# EAGLE schematic Controller-b (EAGLE 6.3)

## Sheet 1 of 2: controller
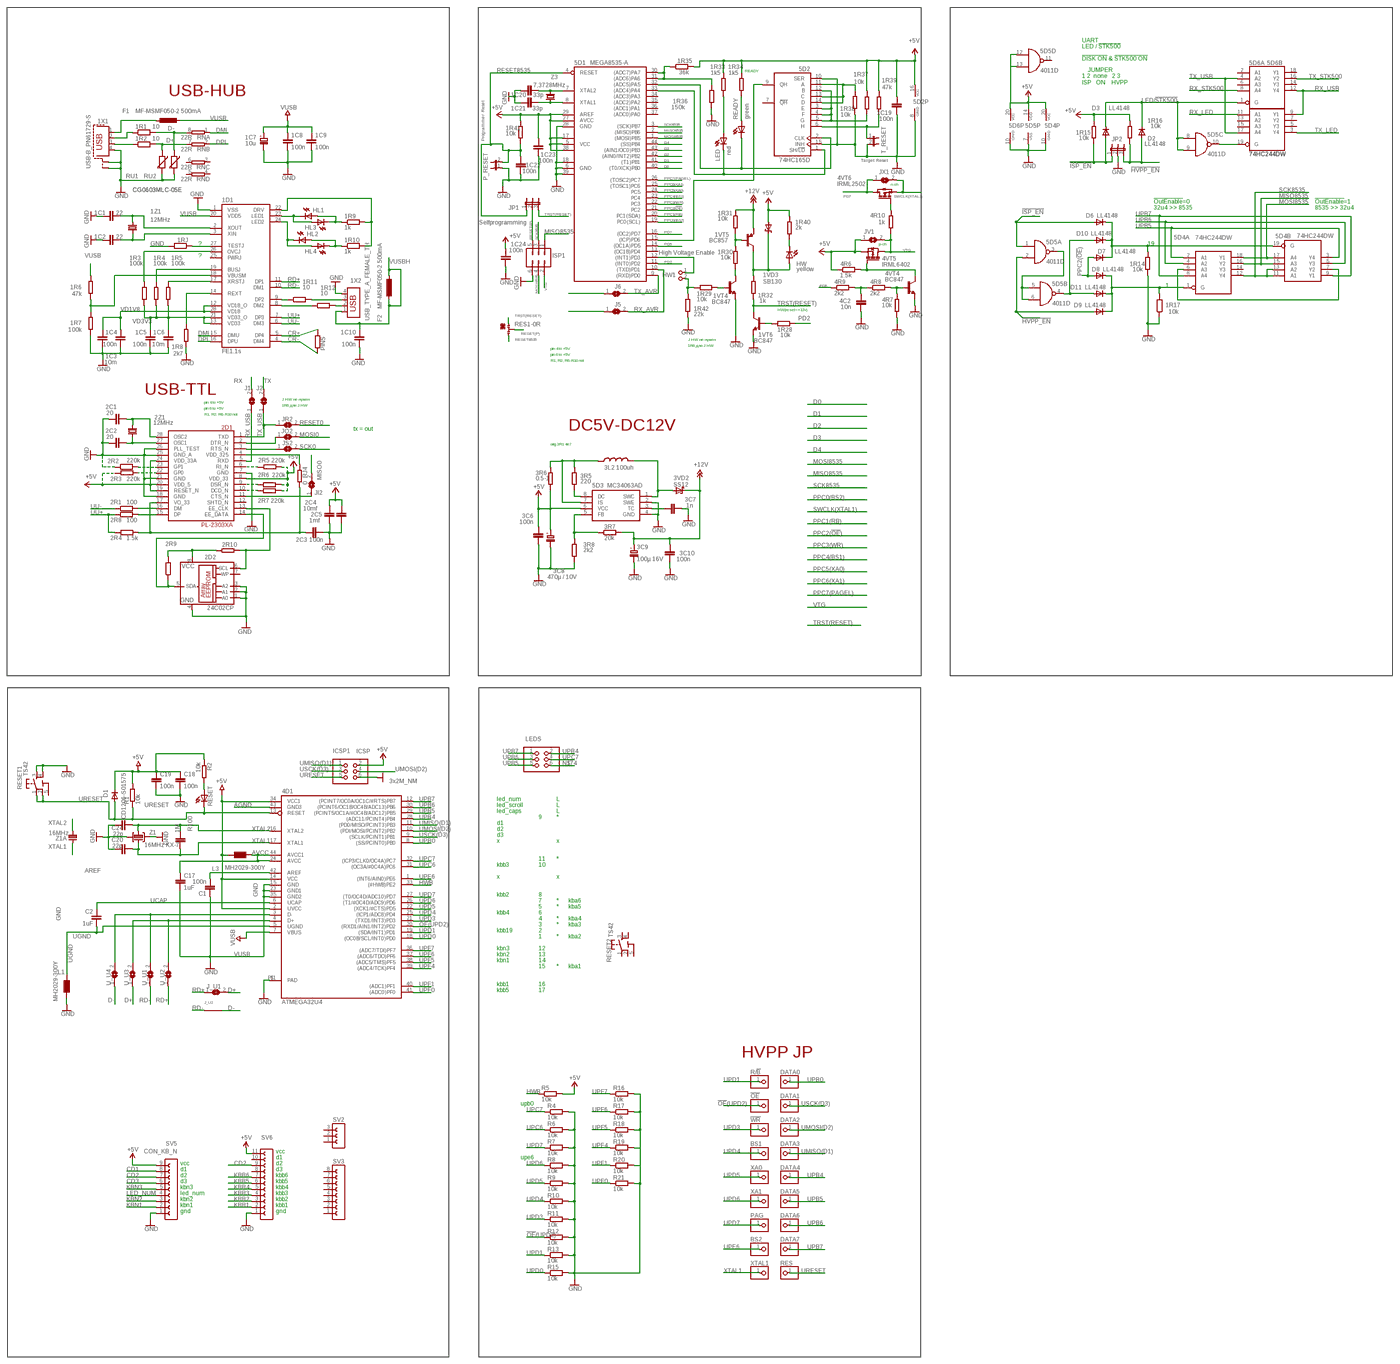
[diagram p0: schematic, sheet 1, overview]
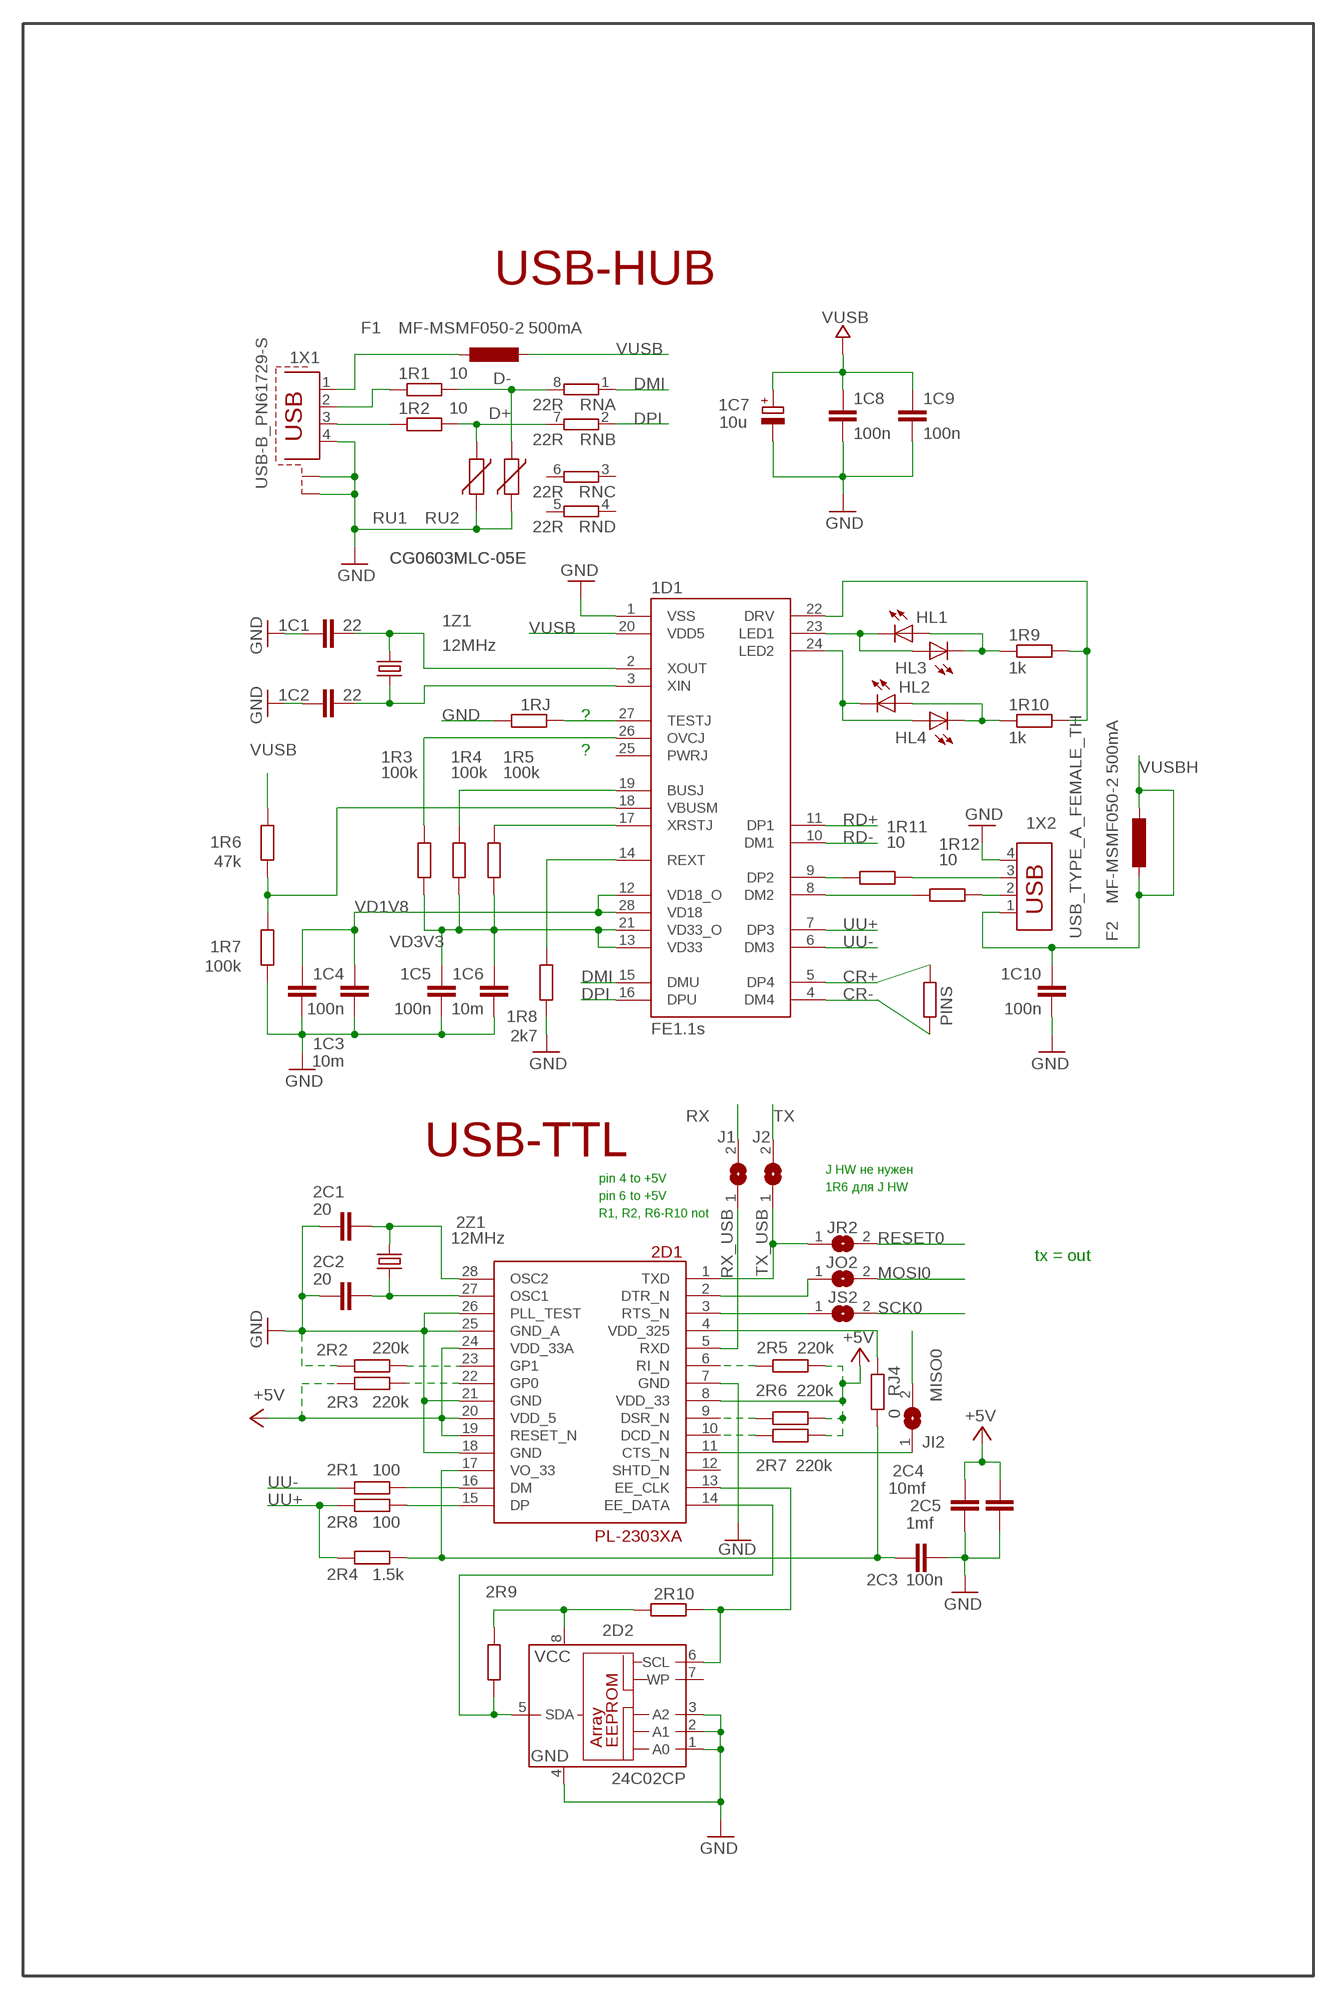
[diagram p1: schematic, sheet 1, part 1 of 4]
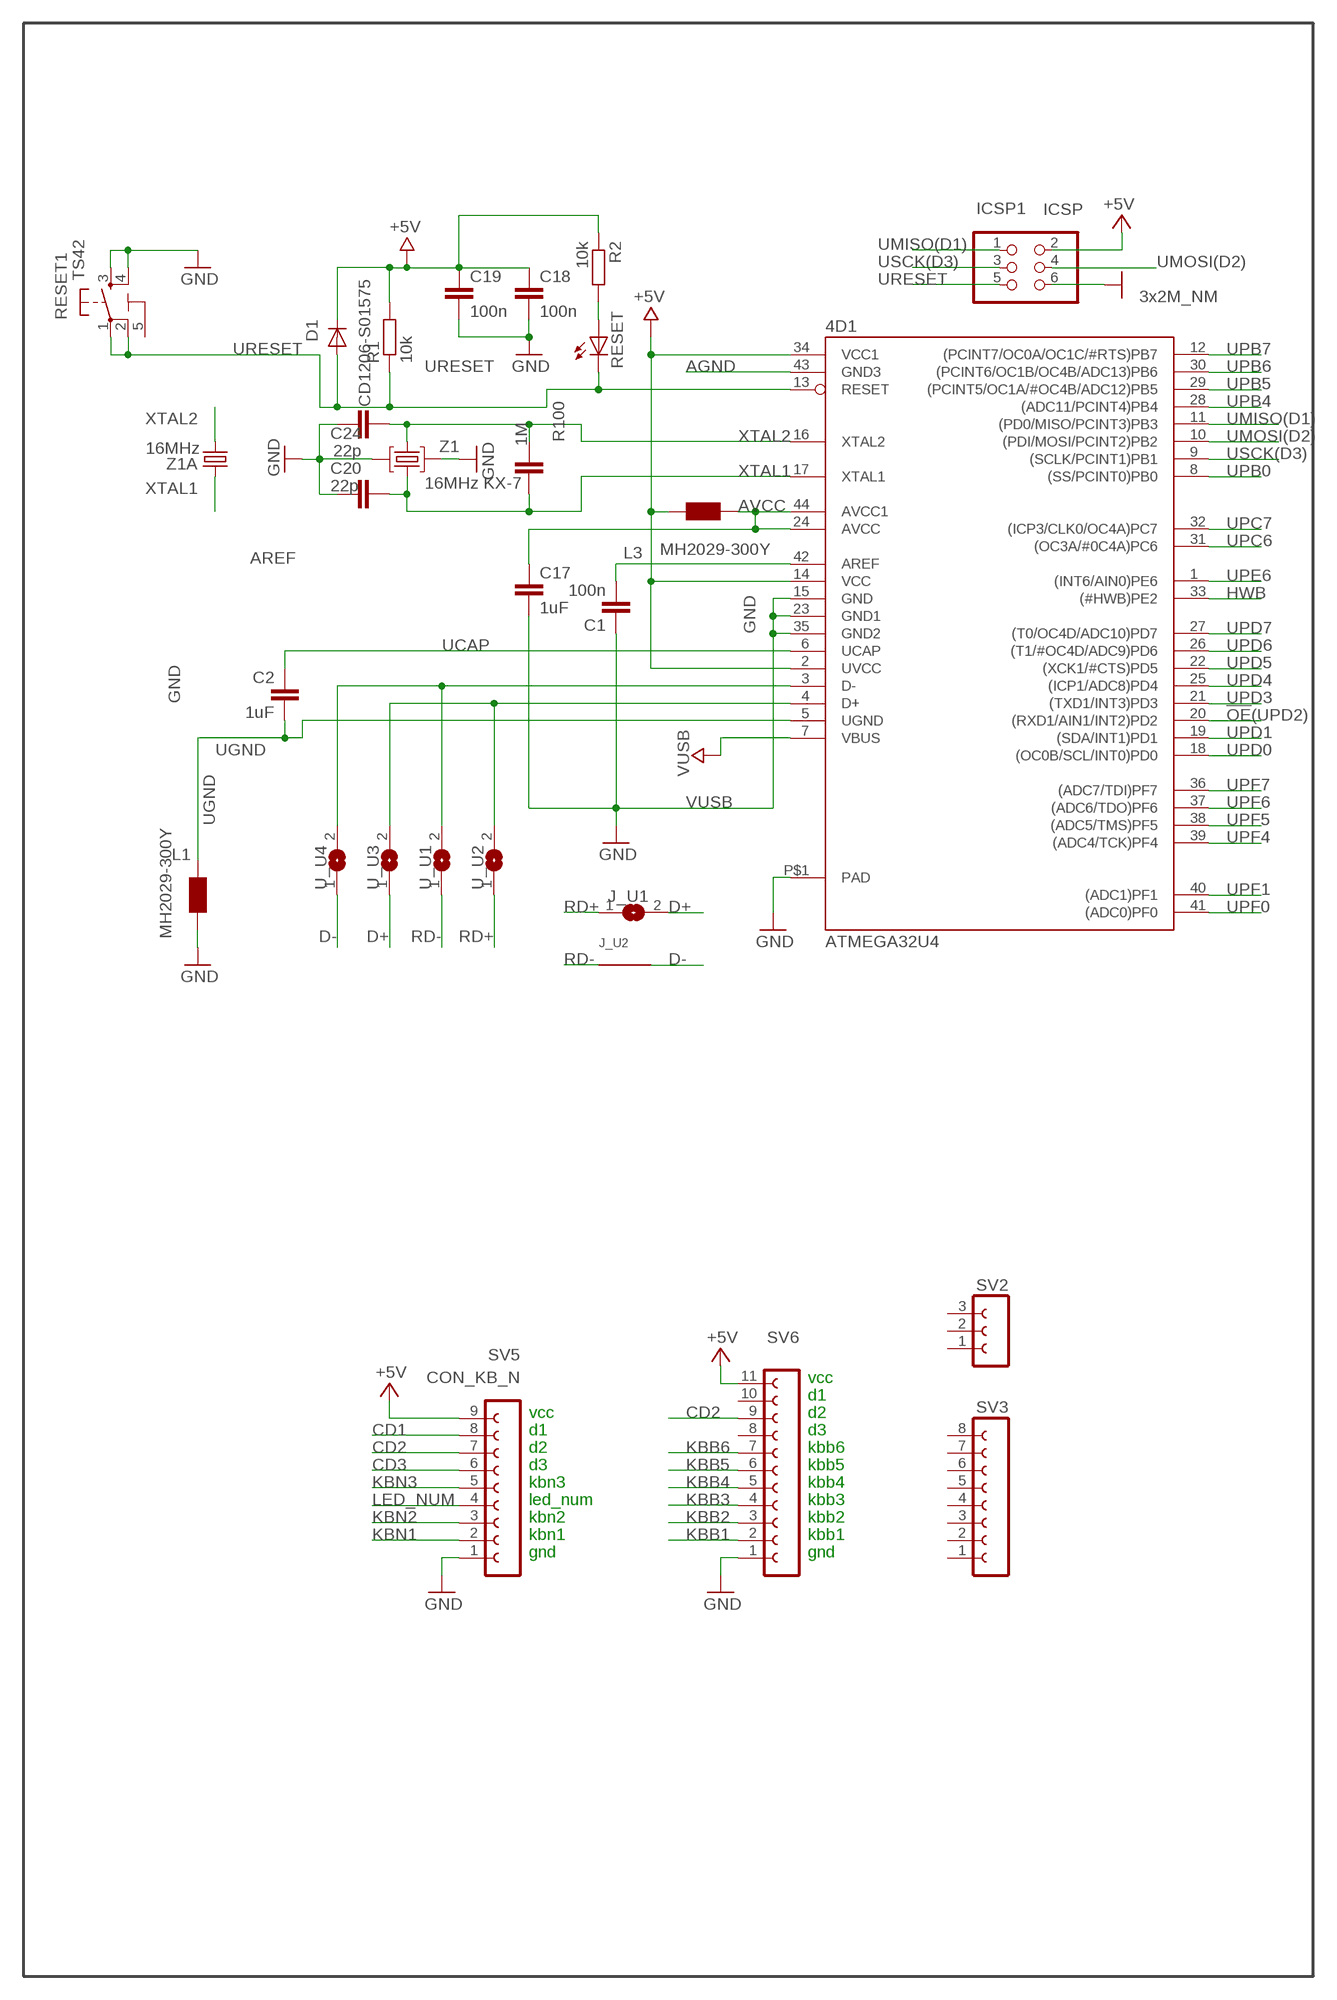
[diagram p2: schematic, sheet 1, part 2 of 4]
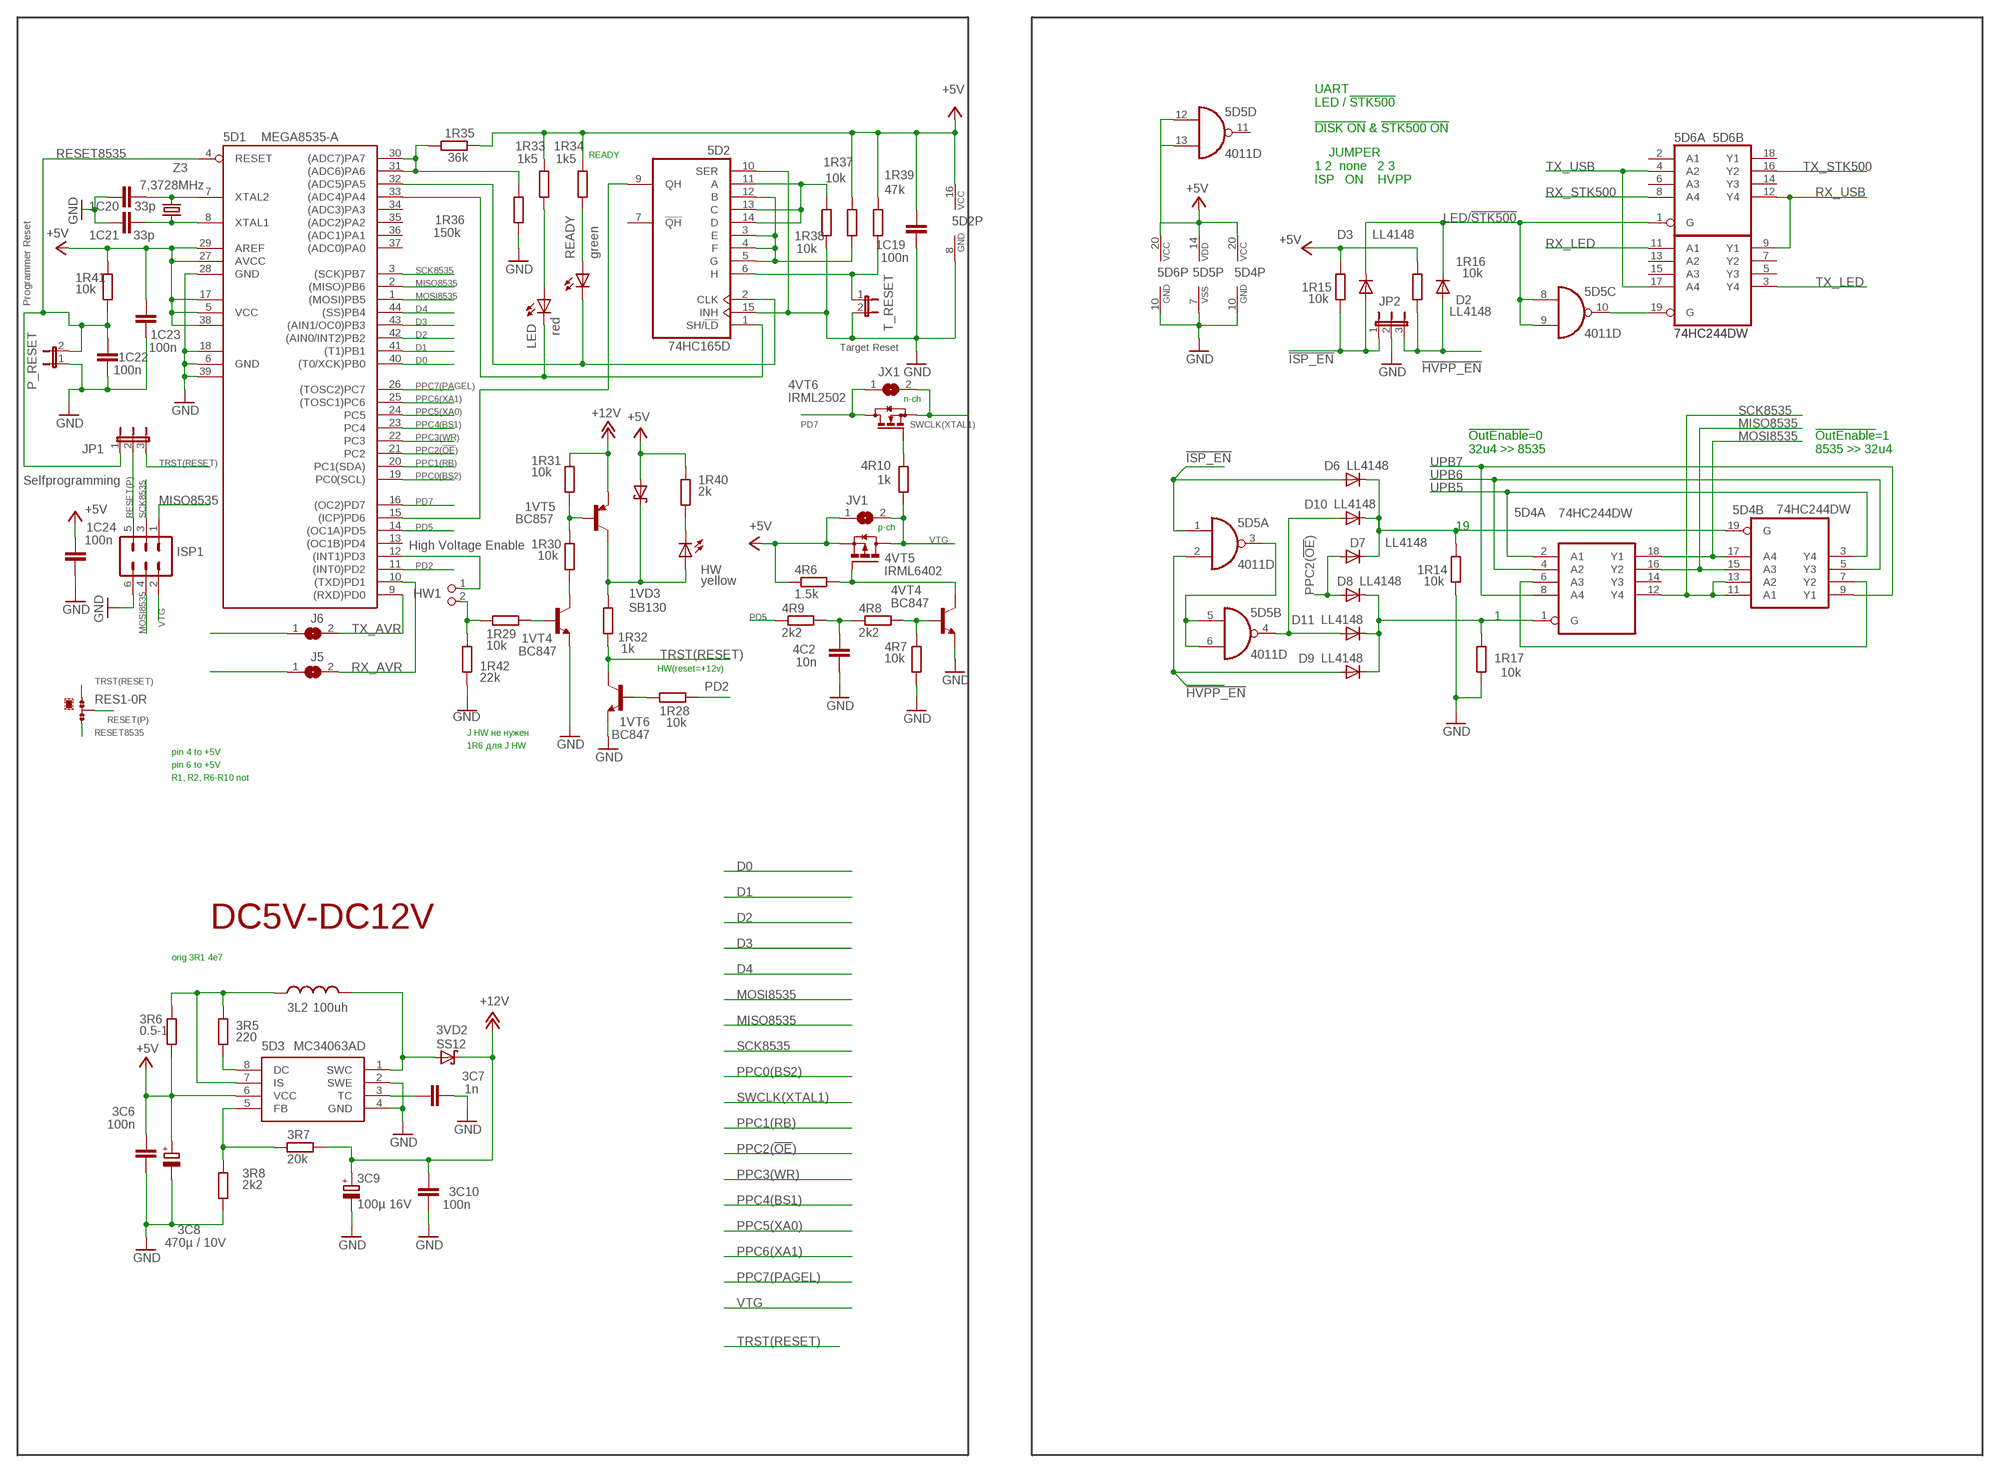
[diagram p3: schematic, sheet 1, part 3 of 4]
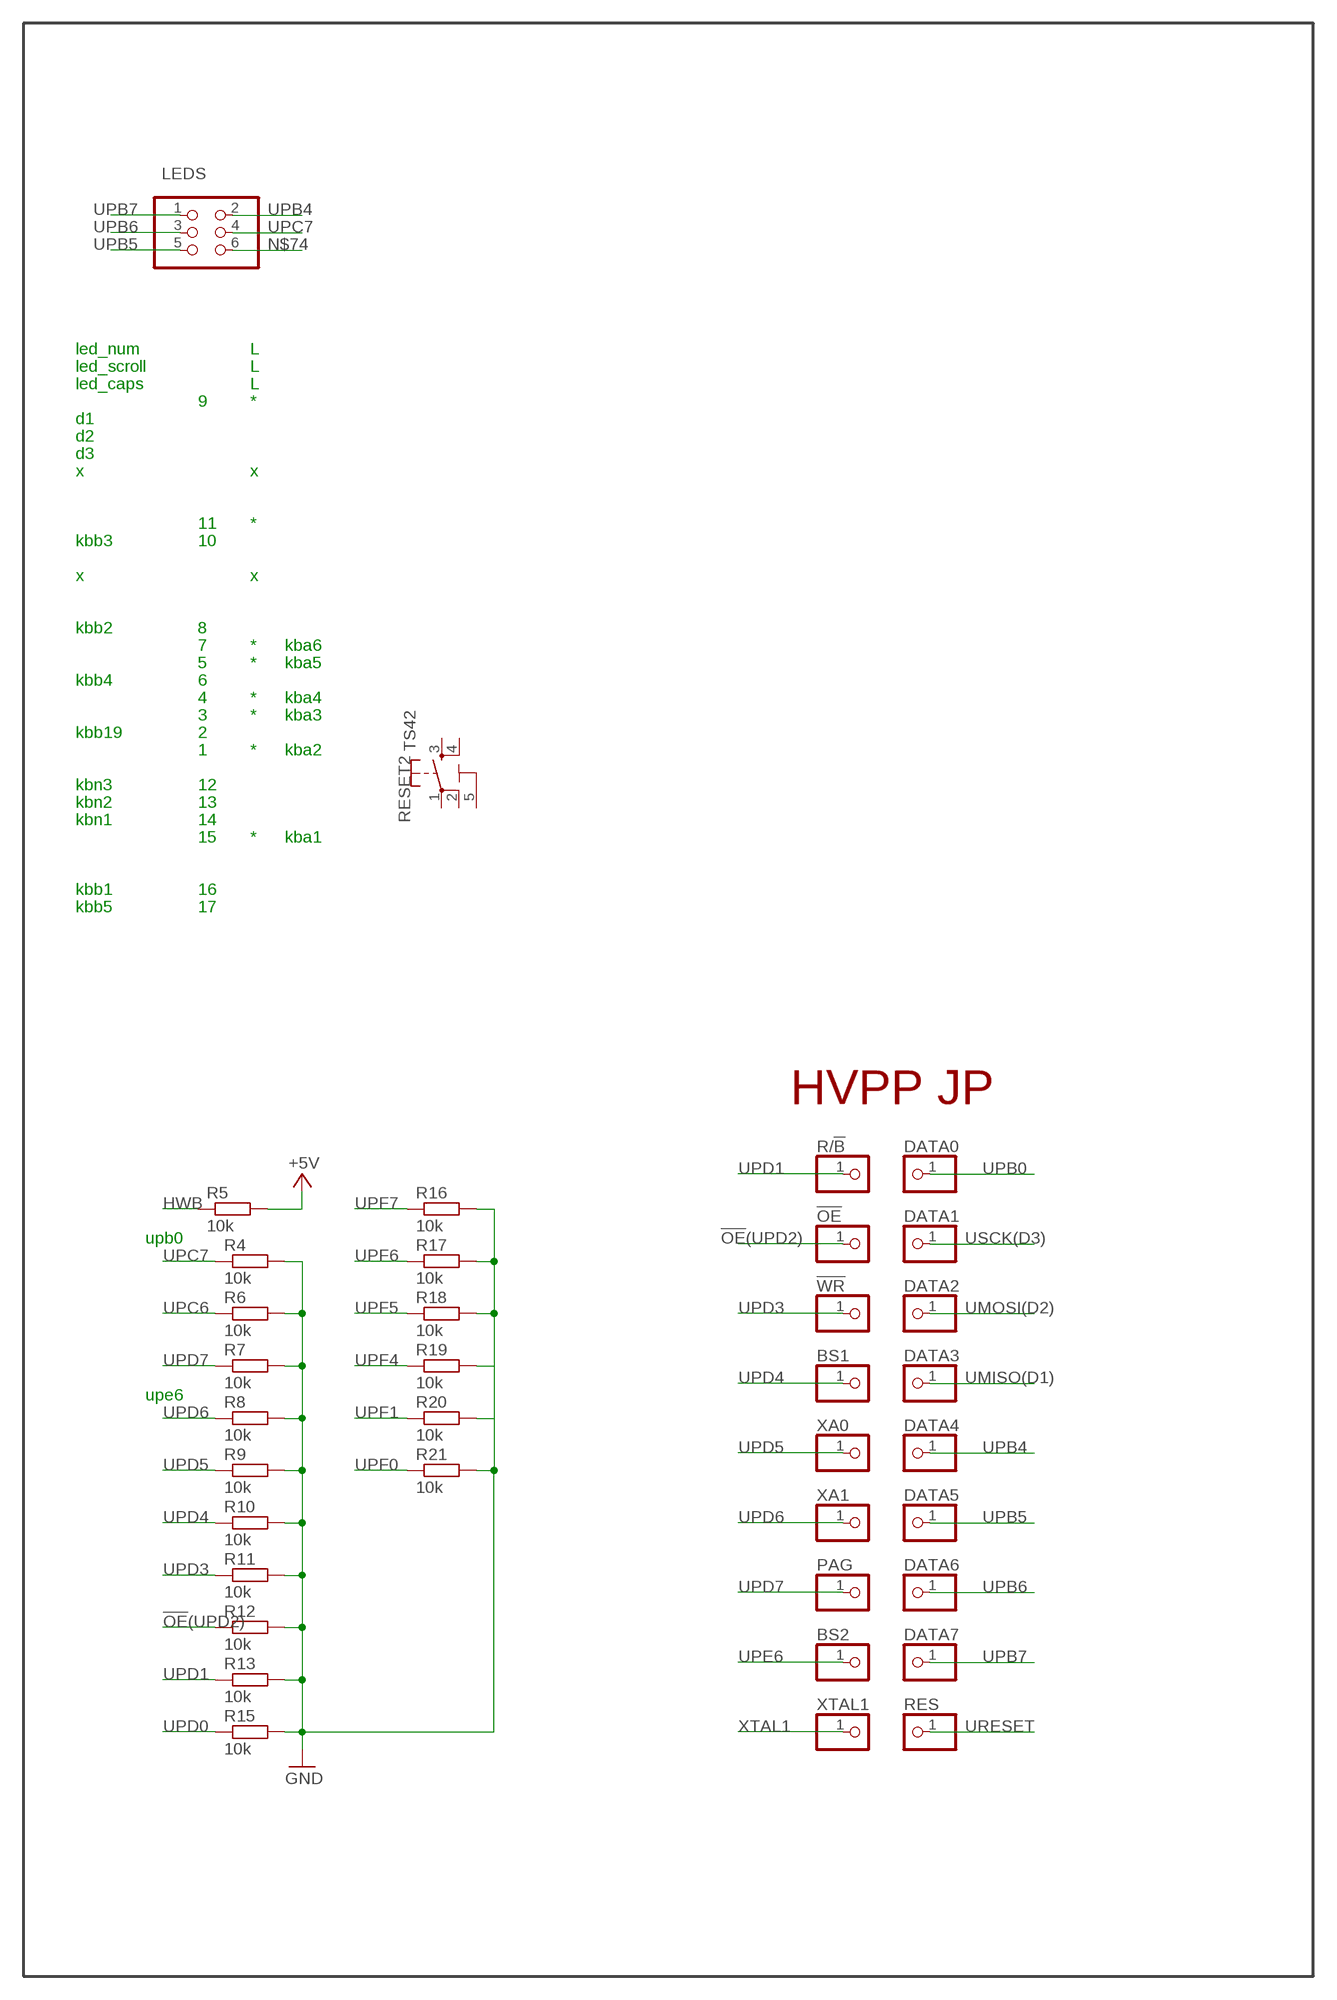
[diagram p4: schematic, sheet 1, part 4 of 4]

### Parts
1C1  22  C-EUC0603  [C0603]
1C2  22  C-EUC0603  [C0603]
1C3  10m  C-EUC1206  [C1206]
1C4  100n  C-EUC0805  [C0805]
1C5  100n  C-EUC0805  [C0805]
1C6  10m  C-EUC1206  [C1206]
1C7  10u  CPOL-EUSMCB  [SMC_B]
1C8  100n  C-EUC0805  [C0805]
1C9  100n  C-EUC0805  [C0805]
1C10  100n  C-EUC0805  [C0805]
1C19  100n  C-EUC0805  [C0805]
1C20  33p  C-EUC0805  [C0805]
1C21  33p  C-EUC0805  [C0805]
1C22  100n  C-EUC0805  [C0805]
1C23  100n  C-EUC0805  [C0805]
1C24  100n  C-EUC0805  [C0805]
1D1  FE1.1S  [FE1.1S_SSOP-28]
1R1  10  R-EU_R0603  [R0603]
1R2  10  R-EU_R0603  [R0603]
1R3  100k  R-EU_R0805  [R0805]
1R4  100k  R-EU_R0805  [R0805]
1R5  100k  R-EU_R1206W  [R1206W]
1R6  47k  R-EU_R1206W  [R1206W]
1R7  100k  R-EU_R0805  [R0805]
1R8  2k7  R-EU_R0805  [R0805]
1R9  1k  R-EU_R0805  [R0805]
1R10  1k  R-EU_R0805  [R0805]
1R11  10  R-EU_R0603  [R0603]
1R12  10  R-EU_R0603  [R0603]
1R14  10k  R-EU_M0805  [M0805]
1R15  10k  R-EU_M0805  [M0805]
1R16  10k  R-EU_M0805  [M0805]
1R17  10k  R-EU_M0805  [M0805]
1R28  10k  R-EU_R0805  [R0805]
1R29  10k  R-EU_M0805  [M0805]
1R30  10k  R-EU_M0805  [M0805]
1R31  10k  R-EU_M0805  [M0805]
1R32  1k  R-EU_M0805  [M0805]
1R33  1k5  R-EU_M0805  [M0805]
1R34  1k5  R-EU_M0805  [M0805]
1R35  36k  R-EU_M0805  [M0805]
1R36  150k  R-EU_R1206  [R1206]
1R37  10k  R-EU_M0805  [M0805]
1R38  10k  R-EU_M0805  [M0805]
1R39  47k  R-EU_M0805  [M0805]
1R40  2k  R-EU_R1206W  [R1206W]
1R41  10k  R-EU_M0805  [M0805]
1R42  22k  R-EU_M1206  [M1206]
1RJ  R-EU_R0805  [R0805]
1VD3  SB130  SCHOTTKY-DIODESMD  [SMB]
1VT4  BC847  [SOT23]
1VT5  BC857  BC857A-PNP-SOT23-BEC  [SOT23-BEC]
1VT6  BC847  [SOT23]
1X1  USB-B_PN61729-S  [USB-B_PN61729-S]
1X2  USB_TYPE_A_FEMALE_TH  [USB_TYPE_A_FEMALE_TH]
1Z1  12MHz  CRYSTALHC49S  [HC49/S]
2C1  20  C-EUC0805  [C0805]
2C2  20  C-EUC0805  [C0805]
2C3  100n  C-EUC0805  [C0805]
2C4  10mf  C-EUC1210  [C1210]
2C5  1mf  C-EUC0805  [C0805]
2D1  PL-2303XA  [SSOP28DB]
2D2  24C02CP  [DIL8]
2R1  100  R-EU_R0603  [R0603]
2R2  220k  R-EU_R0603  [R0603]
2R3  220k  R-EU_R1206W  [R1206W]
2R4  1.5k  R-EU_R0603  [R0603]
2R5  220k  R-EU_R1206W  [R1206W]
2R6  220k  R-EU_R0603  [R0603]
2R7  220k  R-EU_R0603  [R0603]
2R8  100  R-EU_R0603  [R0603]
2R9  R-EU_R0805  [R0805]
2R10  R-EU_R0805  [R0805]
2Z1  12MHz  CRYSTALHC49S  [HC49/S]
3C6  100n  C-EU025-024X044  [C025-024X044]
3C7  1n  C-EU025-025X050  [C025-025X050]
3C8  470µ / 10V  RCL_CPOL-EUE3.5-8  [RCL_E3,5-8]
3C9  100µ 16V  RCL_CPOL-EUE3.5-8  [RCL_E3,5-8]
3C10  100n  C-EU025-025X050  [C025-025X050]
3L2  100uh  L-US0207/10  [0207/10]
3R5  220  R-EU_R1206  [R1206]
3R6  0.5-1  R-EU_M1206  [M1206]
3R7  20k  R-EU_M0805  [M0805]
3R8  2k2  R-EU_M0805  [M0805]
3VD2  SS12  SCHOTTKY-DIODESMD  [SMB]
4C2  10n  C-EUC1206  [C1206]
4D1  ATMEGA32U4  SMARTPRJ_ATMEGA32U4-XUAU  [SMARTPRJ_TQFP44-PAD]
4R6  1.5k  R-EU_M0805  [M0805]
4R7  10k  R-EU_M0805  [M0805]
4R8  2k2  R-EU_M1206  [M1206]
4R9  2k2  R-EU_M0805  [M0805]
4R10  1k  R-EU_M0805  [M0805]
4VT4  BC847  [SOT23]
4VT5  IRML6402  FDN360P  [SUPER-SOT3]
4VT6  IRML2502  BSS123  [SOT23]
5D1  MEGA8535-A  [TQFP44]
5D2  74HC165D  [SO16]
5D3  MC34063AD  [SOIC8]
5D4  74HC244DW  [SO20W]
5D5  4011D  [SO14]
5D6  74HC244DW  [SO20W]
!OE  PINHD-1X1  [1X01]
!WR  PINHD-1X1  [1X01]
BS1  PINHD-1X1  [1X01]
BS2  PINHD-1X1  [1X01]
C1  100n  C-EUC0603  [C0603-ROUND]
C2  1uF  C-EUC0603  [C0603]
C17  1uF  C-EUC0603  [C0603-ROUND]
C18  100n  C-EUC0603  [C0603]
C19  100n  C-EUC0603  [C0603-ROUND]
C20  22p  C-EUC0603  [C0603]
C24  22p  C-EUC0603  [C0603]
D1  CD1206-S01575  DIODE-MINIMELF  [MINIMELF]
D2  LL4148  [SOD80C]
D3  LL4148  [SOD80C]
D6  LL4148  [SOD80C]
D7  LL4148  [SOD80C]
D8  LL4148  [SOD80C]
D9  LL4148  [SOD80C]
D10  LL4148  [SOD80C]
D11  LL4148  [SOD80C]
DATA0  PINHD-1X1  [1X01]
DATA1  PINHD-1X1  [1X01]
DATA2  PINHD-1X1  [1X01]
DATA3  PINHD-1X1  [1X01]
DATA4  PINHD-1X1  [1X01]
DATA5  PINHD-1X1  [1X01]
DATA6  PINHD-1X1  [1X01]
DATA7  PINHD-1X1  [1X01]
F1  MF-MSMF050-2 500mA  L-EUL1812  [L1812]
F2  MF-MSMF050-2 500mA  L-EUL1812  [L1812]
HL1  LEDSML0603  [SML0603]
HL2  LEDSML0603  [SML0603]
HL3  LEDSML0603  [SML0603]
HL4  LEDSML0603  [SML0603]
HW  yellow  LEDSML0603  [SML0603]
HW1  High Voltage Enable  PINHEAD_PINHD-1X2  [PINHEAD_1X02]
ICSP1  ICSP  PINHD-2X3  [2X03]
ISP1  MA03-2  [MA03-2]
J1  SJ  [SJ]
J2  SJ  [SJ]
J5  SJ  [SJ]
J6  SJ  [SJ]
J_U1  SJ  [SJ]
J_U2  J  [R1206W]
JI2  SJ  [SJ]
JO2  SJ  [SJ]
JP1  Selfprogramming  JUMPER_JP2E  [JUMPER_JP2]
JP2  JP2E  [JP2]
JR2  SJ  [SJ]
JS2  SJ  [SJ]
JV1  SJ  [SJ]
JX1  SJ  [SJ]
L1  MH2029-300Y  WE-CBF_0805  [0805]
L3  MH2029-300Y  WE-CBF_0805  [0805]
LED  red  LEDSML0603  [SML0603]
LEDS  PINHD-2X3  [2X03]
P_RESET  JP1E  [JP1]
PAG  PINHD-1X1  [1X01]
PINS  R-EU_R0805  [R0805]
R1  10k  R-EU_M0805  [M0805]
R2  10k  R-EU_M0805  [M0805]
R4  10k  R-EU_M0805  [M0805]
R5  10k  R-EU_M1206  [M1206]
R6  10k  R-EU_M0805  [M0805]
R7  10k  R-EU_M0805  [M0805]
R8  10k  R-EU_M0805  [M0805]
R9  10k  R-EU_M0805  [M0805]
R10  10k  R-EU_M0805  [M0805]
R11  10k  R-EU_M0805  [M0805]
R12  10k  R-EU_M0805  [M0805]
R13  10k  R-EU_M0805  [M0805]
R15  10k  R-EU_M0805  [M0805]
R16  10k  R-EU_M0805  [M0805]
R17  10k  R-EU_M0805  [M0805]
R18  10k  R-EU_M0805  [M0805]
R19  10k  R-EU_M0805  [M0805]
R20  10k  R-EU_M0805  [M0805]
R21  10k  R-EU_M0805  [M0805]
R100  1M  C-EUC0805  [C0805]
R/!B  PINHD-1X1  [1X01]
READY  green  LEDSML0603  [SML0603]
RES  PINHD-1X1  [1X01]
RES1  0R-JUMPA  [A0R-JMP]
RESET  LEDSML0805  [SML0805]
RESET1  TS42  [TS42]
RESET2  TS42  [TS42]
RJ4  0  R-EU_R1206  [R1206]
RN  22R  4R-NCAY16  [CAY16]
RU1  CG0603MLC-05E  VARISTORCN0603  [CT/CN0603]
RU2  CG0603MLC-05E  VARISTORCN0603  [CT/CN0603]
SV2  FE03-1  [FE03-1]
SV3  FE08-1  [FE08]
SV5  CON_KB_N  FE09-1  [FE09]
SV6  FE12-1  [FE12]
T_RESET  JP1E  [JP1]
U_U1  SJ  [SJ]
U_U2  SJ  [SJ]
U_U3  SJ  [SJ]
U_U4  SJ  [SJ]
XA0  PINHD-1X1  [1X01]
XA1  PINHD-1X1  [1X01]
XTAL1  PINHD-1X1  [1X01]
Z1  16MHz KX-7  CRYSTAL-3.2-2.5  [CRYSTAL-3.2-2.5]
Z1A  16MHz  CRYSTALHC49S  [HC49/S]
Z3  7,3728MHz  CRYTALHC49U-V  [HC49U-V]

### Nets
3VUSB2: 2C3.1 2D1.17(VO_33) 2R4.1 RJ4.2
!HVPP_EN: 1R16.1 5D5.2(A:I1) D2.A D9.A JP2.3
!ISP_EN: 1R15.1 5D5.1(A:I0) D3.A D6.A JP2.1
!OE741: 1R17.2 5D4.1(A:G) D8.C D9.C D11.C
!OE!(UPD2): 4D1.20((RXD1/AIN1/INT2)PD2) !OE.1 R12.1
+5V: 1C19.1 1C23.2 1C24.2 1R15.2 1R16.2 1R33.2 1R34.2 1R35.2 1R37.1 1R39.1 1R40.2 1R41.2 1VD3.A 2C4.2 2C5.2 2D1.8(VDD_33) 2D1.19(RESET_N) 2D1.20(VDD_5) 2D1.24(VDD_33A) 2R3.1 2R5.2 2R6.1 2R7.1 3C6.1 3C8.+ 3R6.1 4D1.2(UVCC) 4D1.14(VCC) 4D1.34(VCC1) 4R6.1 4VT5.2(S) 5D1.5(VCC) 5D1.17(VCC1) 5D1.27(AVCC) 5D1.29(AREF) 5D1.38(VCC2) 5D2.16(VCC) 5D3.6(VCC) 5D4.20(P:VCC) 5D5.12(D:I0) 5D5.13(D:I1) 5D5.14(P:VDD) 5D6.20(P:VCC) C18.1 C19.1 D1.C ICSP1.2 JV1.1 L3.1 R1.2 R2.1 R5.2 SV5.9 SV6.11 ; also sheet 2
+12V: 1R31.2 1VT5.E 3C9.+ 3C10.2 3R7.2 3VD2.C
AGND: 4D1.43(GND3)
AREF [aref]: 4D1.42(AREF) C1.2
AVCC: 4D1.24(AVCC) 4D1.44(AVCC1) C17.1 L3.2
CD1: SV5.8
CD2: SV5.7 SV6.9
CD3: SV5.6
CR+: 1D1.5(DP4) PINS.2
CR-: 1D1.4(DM4) PINS.1
D0: 5D1.40((T0/XCK)PB0)
D1: 5D1.41((T1)PB1)
D2: 5D1.42((AIN0/INT2)PB2)
D3: 5D1.43((AIN1/OC0)PB3)
D4: 5D1.44((SS)PB4) ; also sheet 2
D+: 1R2.2 J_U1.2 RN.7 RU1.1 U_U3.1
D-: 1R1.2 J_U2.1 RN.8 RU2.1 U_U4.1
DMI: 1D1.15(DMU) RN.1
DPI: 1D1.16(DPU) RN.2
GND: 1C1.1 1C2.1 1C3.2 1C4.2 1C5.2 1C6.2 1C7.- 1C8.1 1C9.1 1C10.2 1C19.2 1C20.1 1C21.1 1C22.1 1C23.1 1C24.1 1D1.1(VSS) 1R7.1 1R8.1 1R14.1 1R17.1 1R36.1 1R38.1 1R42.1 1RJ.2 1VT4.2(E) 1VT6.2(E) 1X1.4 1X1.S1 1X1.S2 1X2.4 2C1.1 2C2.1 2C3.2 2C4.1 2C5.1 2D1.7(GND) 2D1.18(GND) 2D1.21(GND) 2D1.25(GND_A) 2D1.26(PLL_TEST) 2D2.1(A0) 2D2.2(A1) 2D2.3(A2) 2D2.4(GND) 2R2.1 3C6.2 3C7.2 3C8.- 3C9.- 3C10.1 3R8.1 4C2.1 4D1.15(GND) 4D1.23(GND1) 4D1.35(GND2) 4D1.P$1(PAD) 4R7.1 4VT4.2(E) 5D1.6(GND) 5D1.18(GND1) 5D1.28(GND) 5D1.39(GND2) 5D2.8(GND) 5D2.10(SER) 5D2.15(INH) 5D3.2(SWE) 5D3.4(GND) 5D4.10(P:GND) 5D5.7(P:VSS) 5D6.10(P:GND) C1.1 C17.2 C18.2 C19.2 C20.1 C24.2 ICSP1.6 ISP1.6 JP2.2 L1.2 P_RESET.1 R4.2 R6.2 R7.2 R8.2 R9.2 R10.2 R11.2 R12.2 R13.2 R15.2 R16.2 R17.2 R18.2 R19.2 R20.2 R21.2 RESET1.3 RESET1.4 RU1.2 RU2.2 SV5.1 SV6.1 T_RESET.2 Z1.2(GND) Z1.4(GND) ; supply symbol labelled 3x2M_NM ; also sheet 2
HWB: 4D1.33((#HWB)PE2) R5.1 ; also sheet 2
ID+: 1R2.1 1X1.3
ID-: 1R1.1 1X1.2
KBB1: SV6.2
KBB2: SV6.3
KBB3: SV6.4
KBB4: SV6.5
KBB5: SV6.6
KBB6: SV6.7
KBN1: SV5.2
KBN2: SV5.3
KBN3: SV5.5
LED/!STK500: 5D5.8(C:I0) 5D5.9(C:I1) 5D6.1(A:G) D2.C D3.C
LED_NUM: SV5.4
MISO0: JI2.2 ; also sheet 2
MISO8535: 5D1.2((MISO)PB6) 5D4.15(B:A3) 5D4.16(A:Y2) ISP1.1
MOSI0: JO2.2 ; also sheet 2
MOSI8535: 5D1.1((MOSI)PB5) 5D4.17(B:A4) 5D4.18(A:Y1) ISP1.4
N1: 5D1.33((ADC4)PA4) 5D2.1(SH/!LD) LED.C
N$2: 5D5.10(C:O) 5D6.19(B:G)
N$3: R2.2 RESET.A
N$4: 5D4.6(A:A3) 5D4.7(B:Y2)
N$5: 1D1.9(DP2) 1R11.1
N$6: 1D1.8(DM2) 1R12.1
N$7: 1X1.1 F1.2
N$8: 1C1.2 1D1.2(XOUT) 1Z1.1
N$9: 1C2.2 1D1.3(XIN) 1Z1.2
N$10: 1D1.17(XRSTJ) 1R5.2
N$11: 1D1.22(DRV) 1R9.2 1R10.2
N$12: 1R11.2 1X2.3
N$13: 1R12.2 1X2.2
N$14: 1D1.23(LED1) HL1.C HL3.A
N$15: 1D1.19(BUSJ) 1R4.2
N$16: 1D1.18(VBUSM) 1R6.1 1R7.2
N$17: 1D1.24(LED2) HL2.C HL4.A
N$18: 1R10.1 HL2.A HL4.C
N$19: 1D1.26(OVCJ) 1R3.2
N$20: 4D1.4(D+) U_U2.2 U_U3.2
N$21: 1D1.14(REXT) 1R8.2
N$23: 1D1.27(TESTJ) 1RJ.1
N$25: 4D1.3(D-) U_U1.2 U_U4.2
N$28: 1R34.1 READY.A
N$29: 5D5.3(A:O) 5D5.5(B:I0) 5D5.6(B:I1)
N$31: 1R9.1 HL1.A HL3.C
N$32: 1R35.1 1R36.2 5D1.30((ADC7)PA7) 5D1.31((ADC6)PA6)
N$33: 5D1.32((ADC5)PA5) 5D2.2(CLK) READY.C
N$34: 1R39.2 5D2.6(H) T_RESET.1
N$35: 5D1.12((INT1)PD3) HW1.1
N$36: 1R29.2 1R42.2 HW1.2
N$37: J6.1
N$39: 1R32.2 1VD3.C 1VT5.C HW.A
N$40: 1R29.1 1VT4.1(B)
N$41: J5.1
N$43: 1R14.2 5D4.19(B:G) D6.C D7.C D10.C
N$45: 1R30.1 1VT4.3(C)
N$46: 1R30.2 1R31.1 1VT5.B
N$47: 5D1.15((ICP)PD6) 5D2.9(QH)
N$48: 1R33.1 LED.A
N$49: 1R38.2 5D2.11(A) 5D2.13(C) 5D2.14(D)
N$52: 2D1.15(DP) 2R8.2
N$53: 2D1.16(DM) 2R1.2
N$54: 2D1.23(GP1) 2R2.2
N$55: 2D1.22(GP0) 2R3.2
N$56: 2C1.2 2D1.28(OSC2) 2Z1.2
N$57: 2C2.2 2D1.27(OSC1) 2Z1.1
N$58: 2D1.6(RI_N) 2R5.1
N$59: 2D1.9(DSR_N) 2R6.2
N$60: 2D1.10(DCD_N) 2R7.2
N$61: 2D1.11(CTS_N) JI2.1
N$62: 2D1.3(RTS_N) JS2.1
N$63: 2D1.2(DTR_N) JO2.1
N$64: 2D1.4(VDD_325) RJ4.1
N$65: 1R37.2 5D2.3(E) 5D2.4(F) 5D2.5(G) 5D2.12(B)
N$66: 2D1.14(EE_DATA) 2D2.5(SDA) 2R9.1
N$67: 2D2.8(VCC) 2R9.2 2R10.2
N$68: 2D1.13(EE_CLK) 2D2.6(SCL) 2R10.1
N$69: 1R28.2 1VT6.1(B)
N$70: 3R5.1 5D3.8(DC)
N$74: LEDS.6
N$75: 3L2.1 3R5.2 3R6.2 5D3.7(IS)
N$76: 5D5.4(B:O) D10.A D11.A
N$79: 3R7.1 3R8.2 5D3.5(FB)
N$80: 3L2.2 3VD2.A 5D3.1(SWC)
N$81: 3C7.1 5D3.3(TC)
N$82: 1C20.2 5D1.7(XTAL2) Z3.2
N$83: 1C21.2 5D1.8(XTAL1) Z3.1
N$84: 4R6.2 4VT4.3(C) 4VT5.1(G)
N$85: 4R7.2 4R8.2 4VT4.1(B)
N$86: 4C2.2 4R8.1 4R9.2
N$95: 1R40.1 HW.C
N$96: 4R10.2 4VT6.1(G)
PD2: 1R28.1 5D1.11((INT0)PD2)
PD5: 4R9.1 5D1.14((OC1A)PD5)
PD7: 4VT6.3(D) 5D1.16((OC2)PD7) JX1.1
PPC0(BS2): 5D1.19(PC0(SCL))
PPC1(RB): 5D1.20(PC1(SDA))
PPC2(!OE!): 5D1.21(PC2) D7.A D8.A
PPC3(WR): 5D1.22(PC3)
PPC4(BS1): 5D1.23(PC4)
PPC5(XA0): 5D1.24(PC5)
PPC6(XA1): 5D1.25((TOSC1)PC6)
PPC7(PAGEL): 5D1.26((TOSC2)PC7)
RD+: 1D1.11(DP1) J_U1.1 U_U2.1
RD-: 1D1.10(DM1) J_U2.2 U_U1.1
RESET0: JR2.2 ; also sheet 2
RESET8535: 1C22.2 1R41.1 5D1.4(RESET) JP1.1 P_RESET.2 RES1.3
RESET(P): ISP1.5 JP1.2 RES1.2
RX: J1.2
RX_AVR: 5D1.10((TXD)PD1) J5.2
RX_LED: 5D6.11(B:A1)
RX_STK500: 5D6.8(A:A4)
RX_USB: 2D1.5(RXD) 5D6.9(B:Y1) 5D6.12(A:Y4) J1.1
SCK0: JS2.2 ; also sheet 2
SCK8535: 5D1.3((SCK)PB7) 5D4.11(B:A1) 5D4.12(A:Y4) 5D4.13(B:A2) ISP1.3
SWCLK(XTAL1): 4VT6.2(S) JX1.2
TRST(RESET): 1R32.1 1VT6.3(C) JP1.3 RES1.1
TX: J2.2
TX_AVR: 5D1.9((RXD)PD0) J6.2
TX_LED: 5D6.3(B:Y4)
TX_STK500: 5D6.16(A:Y2)
TX_USB: 2D1.1(TXD) 5D6.4(A:A2) 5D6.17(B:A4) J2.1 JR2.1
UCAP: 4D1.6(UCAP) C2.1
UGND [gnd]: 4D1.5(UGND) C2.2 L1.1
UMISO(D1): 4D1.11((PD0/MISO/PCINT3)PB3) DATA3.1 ICSP1.1
UMOSI(D2): 4D1.10((PDI/MOSI/PCINT2)PB2) DATA2.1 ICSP1.4
UPB0: 4D1.8((SS/PCINT0)PB0) DATA0.1
UPB4: 4D1.28((ADC11/PCINT4)PB4) DATA4.1 LEDS.2
UPB5: 4D1.29((PCINT5/OC1A/#OC4B/ADC12)PB5) 5D4.2(A:A1) 5D4.3(B:Y4) DATA5.1 LEDS.5
UPB6: 4D1.30((PCINT6/OC1B/OC4B/ADC13)PB6) 5D4.4(A:A2) 5D4.5(B:Y3) DATA6.1 LEDS.3
UPB7: 4D1.12((PCINT7/OC0A/OC1C/#RTS)PB7) 5D4.8(A:A4) 5D4.9(B:Y1) DATA7.1 LEDS.1
UPC6: 4D1.31((OC3A/#0C4A)PC6) R6.1
UPC7: 4D1.32((ICP3/CLK0/OC4A)PC7) LEDS.4 R4.1
UPD0: 4D1.18((OC0B/SCL/INT0)PD0) R15.1
UPD1: 4D1.19((SDA/INT1)PD1) R13.1 R/!B.1
UPD3: 4D1.21((TXD1/INT3)PD3) !WR.1 R11.1
UPD4: 4D1.25((ICP1/ADC8)PD4) BS1.1 R10.1
UPD5: 4D1.22((XCK1/#CTS)PD5) R9.1 XA0.1
UPD6: 4D1.26((T1/#OC4D/ADC9)PD6) R8.1 XA1.1
UPD7: 4D1.27((T0/OC4D/ADC10)PD7) PAG.1 R7.1
UPE6: 4D1.1((INT6/AIN0)PE6) BS2.1
UPF0: 4D1.41((ADC0)PF0) R21.1
UPF1: 4D1.40((ADC1)PF1) R20.1
UPF4: 4D1.39((ADC4/TCK)PF4) R19.1
UPF5: 4D1.38((ADC5/TMS)PF5) R18.1
UPF6: 4D1.37((ADC6/TDO)PF6) R17.1
UPF7: 4D1.36((ADC7/TDI)PF7) R16.1
URESET: 4D1.13(RESET) D1.A ICSP1.5 R1.1 RES.1 RESET1.1 RESET1.2 RESET.C
USCK(D3): 4D1.9((SCLK/PCINT1)PB1) DATA1.1 ICSP1.3
UU+: 1D1.7(DP3) 2R4.2 2R8.1
UU-: 1D1.6(DM3) 2R1.1
VD1V8: 1C3.1 1C4.1 1D1.12(VD18_O) 1D1.28(VD18)
VD3V3: 1C5.1 1C6.1 1D1.13(VD33) 1D1.21(VD33_O) 1R3.1 1R4.1 1R5.1
VTG: 4R10.1 4VT5.3(D) ISP1.2 JV1.2
VUSB: 1C7.+ 1C8.2 1C9.2 1D1.20(VDD5) 1R6.2 4D1.7(VBUS) F1.1
VUSBH: 1C10.1 1X2.1 F2.1 F2.2
XTAL1: 4D1.17(XTAL1) C20.2 R100.2 XTAL1.1 Z1.3(C2) Z1A.2
XTAL2: 4D1.16(XTAL2) C24.1 R100.1 Z1.1(C1) Z1A.1
Unconnected: 1D1.25(PWRJ) 2D1.12(SHTD_N) 2D2.7(WP) 5D1.13((OC1B)PD4) 5D1.34((ADC3)PA3) 5D1.35((ADC2)PA2) 5D1.36((ADC1)PA1) 5D1.37((ADC0)PA0) 5D2.7(!QH) 5D4.14(A:Y3) 5D5.11(D:O) 5D6.2(A:A1) 5D6.5(B:Y3) 5D6.6(A:A3) 5D6.7(B:Y2) 5D6.13(B:A2) 5D6.14(A:Y3) 5D6.15(B:A3) 5D6.18(A:Y1) RESET2.1 RESET2.2 RESET2.3 RESET2.4 RN.3 RN.4 RN.5 RN.6 SV2.1 SV2.2 SV2.3 SV3.1 SV3.2 SV3.3 SV3.4 SV3.5 SV3.6 SV3.7 SV3.8 SV6.8 SV6.10

### Notes on the sheet
- UART
  LED / !STK500
- !DISK ON! & !STK500 ON
- READY
- JUMPER
  1 2  none   2 3
  ISP   ON    HVPP
- USB-HUB
- Programmer Reset
- Target Reset
- n-ch
- !OutEnable!=0
  32u4 >> 8535
- !OutEnable!=1
  8535 >> 32u4
- ? | p-ch | 19
- ?
- 1
- HW(reset=+12v)
- J HW не нужен
- 1R6 для J HW
- pin 4 to +5V
- pin 6 to +5V
- R1, R2, R6-R10 not
- USB-TTL
- J HW не нужен
- pin 4 to +5V
- 1R6 для J HW
- pin 6 to +5V
- R1, R2, R6-R10 not
- tx = out | DC5V-DC12V
- orig 3R1 4e7
- led_num | L
- led_scroll | L
- led_caps | L
- 9 | *
- d1
- d2
- d3
- x | x
- 11 | *
- kbb3 | 10
- x | x
- kbb2 | 8
- 7 | * | kba6
- 5 | * | kba5
- kbb4 | 6
- 4 | * | kba4
- 3 | * | kba3
- kbb19 | 2
- 1 | * | kba2
- kbn3 | 12
- kbn2 | 13
- kbn1 | 14
- 15 | * | kba1
- kbb1 | 16
- kbb5 | 17
- HVPP JP
- upb0
- vcc
- d1 | upe6
- vcc | d2
- d1 | d3
- d2 | kbb6
- d3 | kbb5
- kbn3 | kbb4
- led_num | kbb3
- kbn2 | kbb2
- kbn1 | kbb1
- gnd | gnd

## Sheet 2 of 2: куски
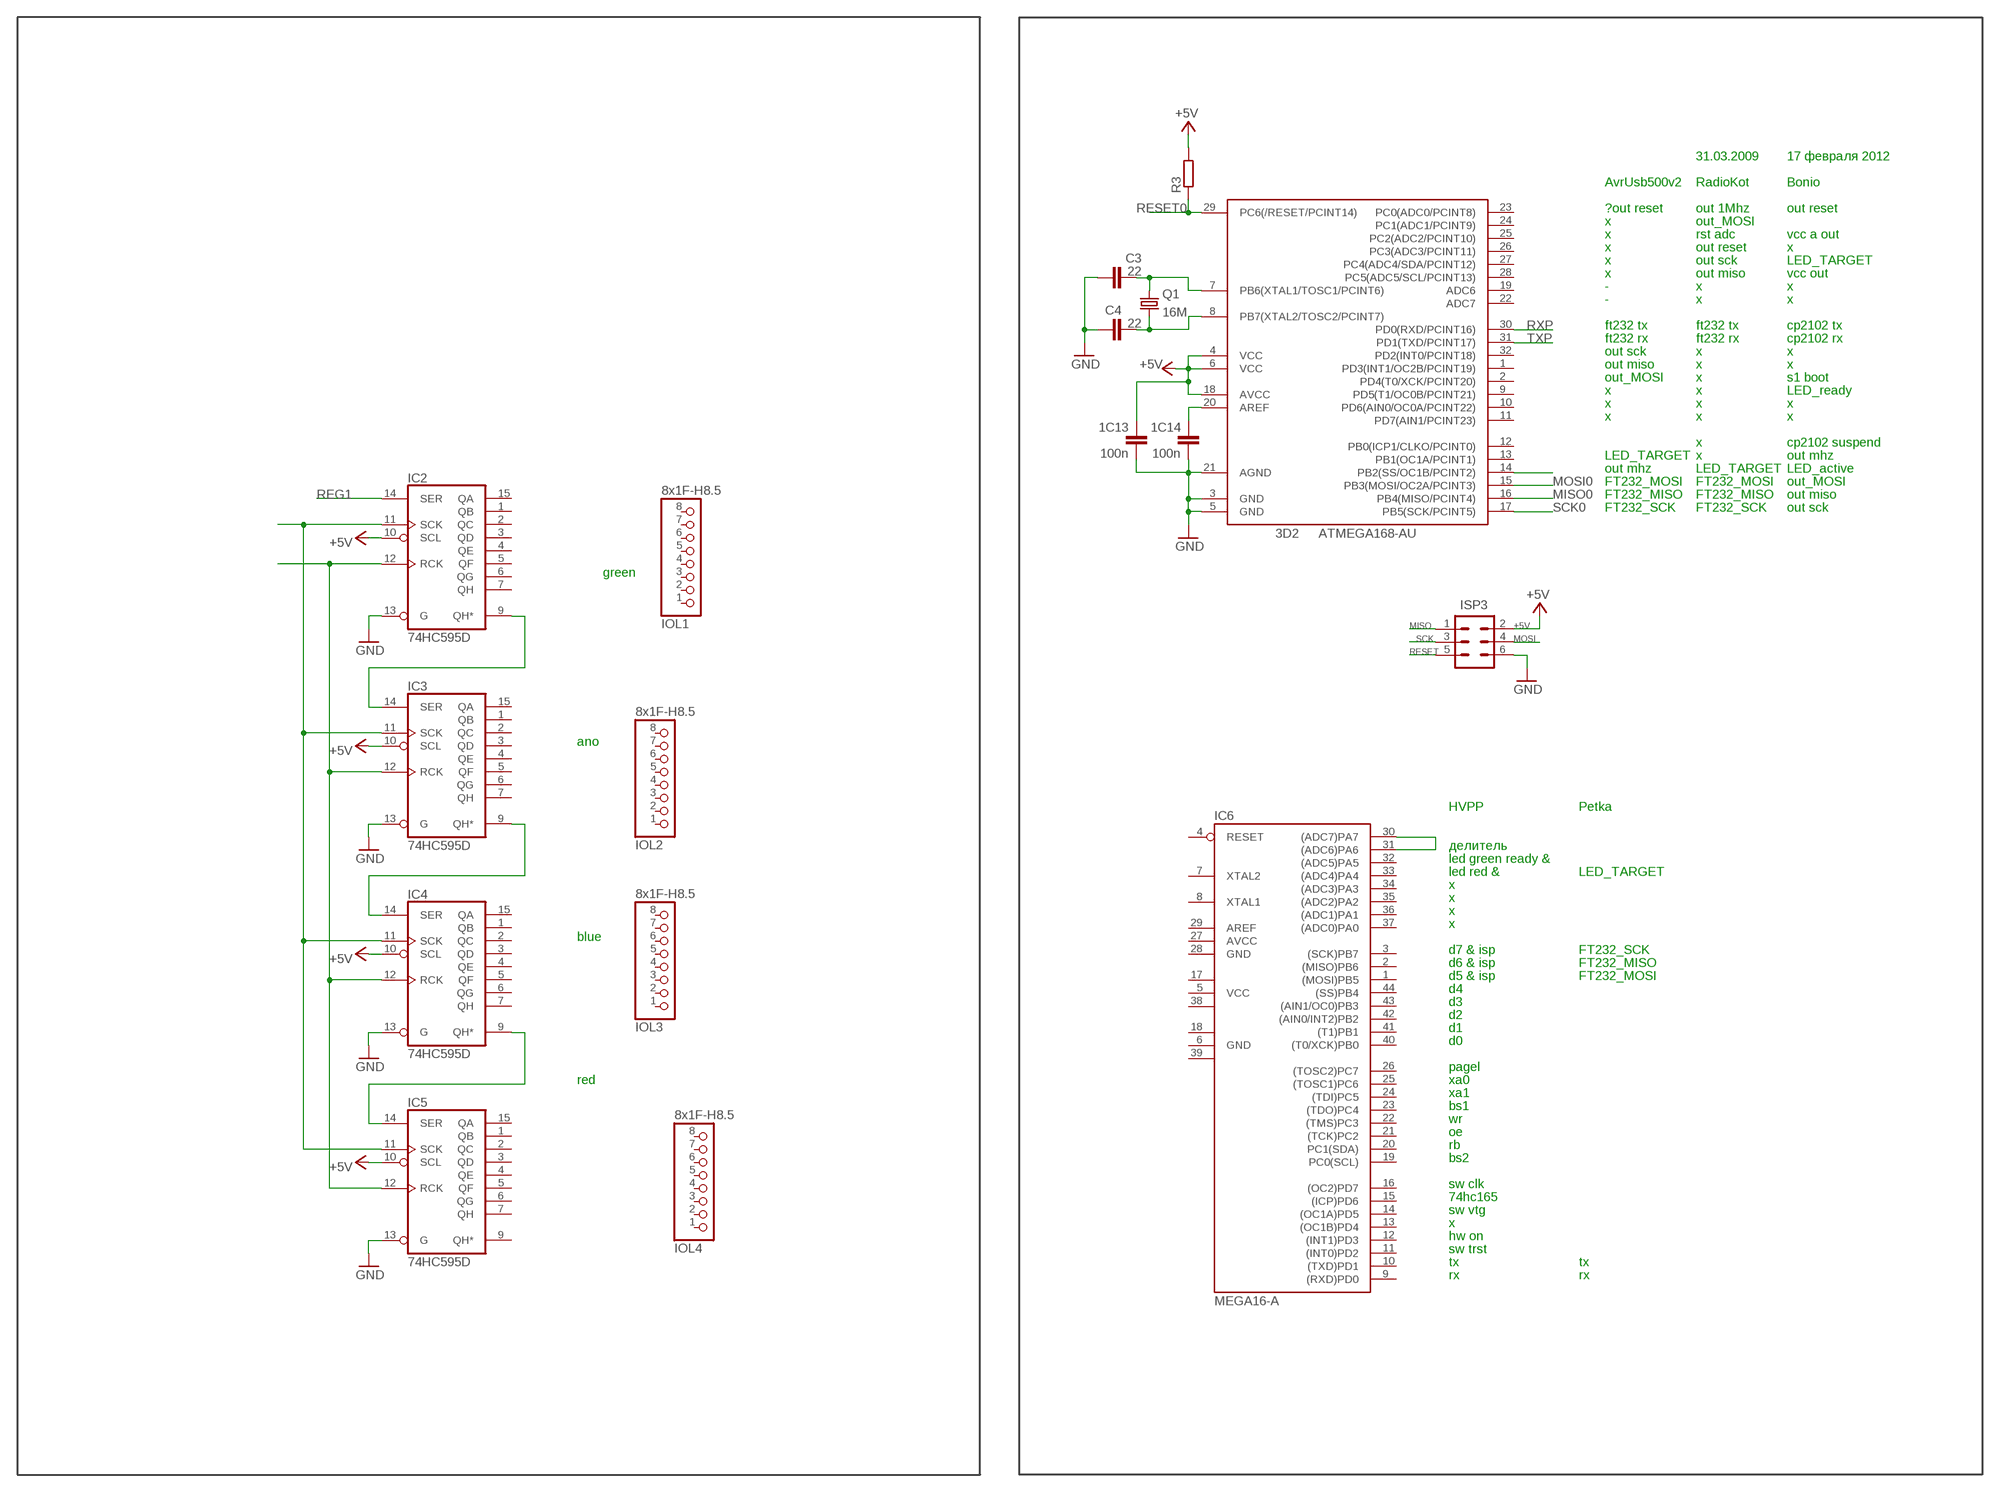
[diagram p5: schematic, sheet 2, part 1 of 3]
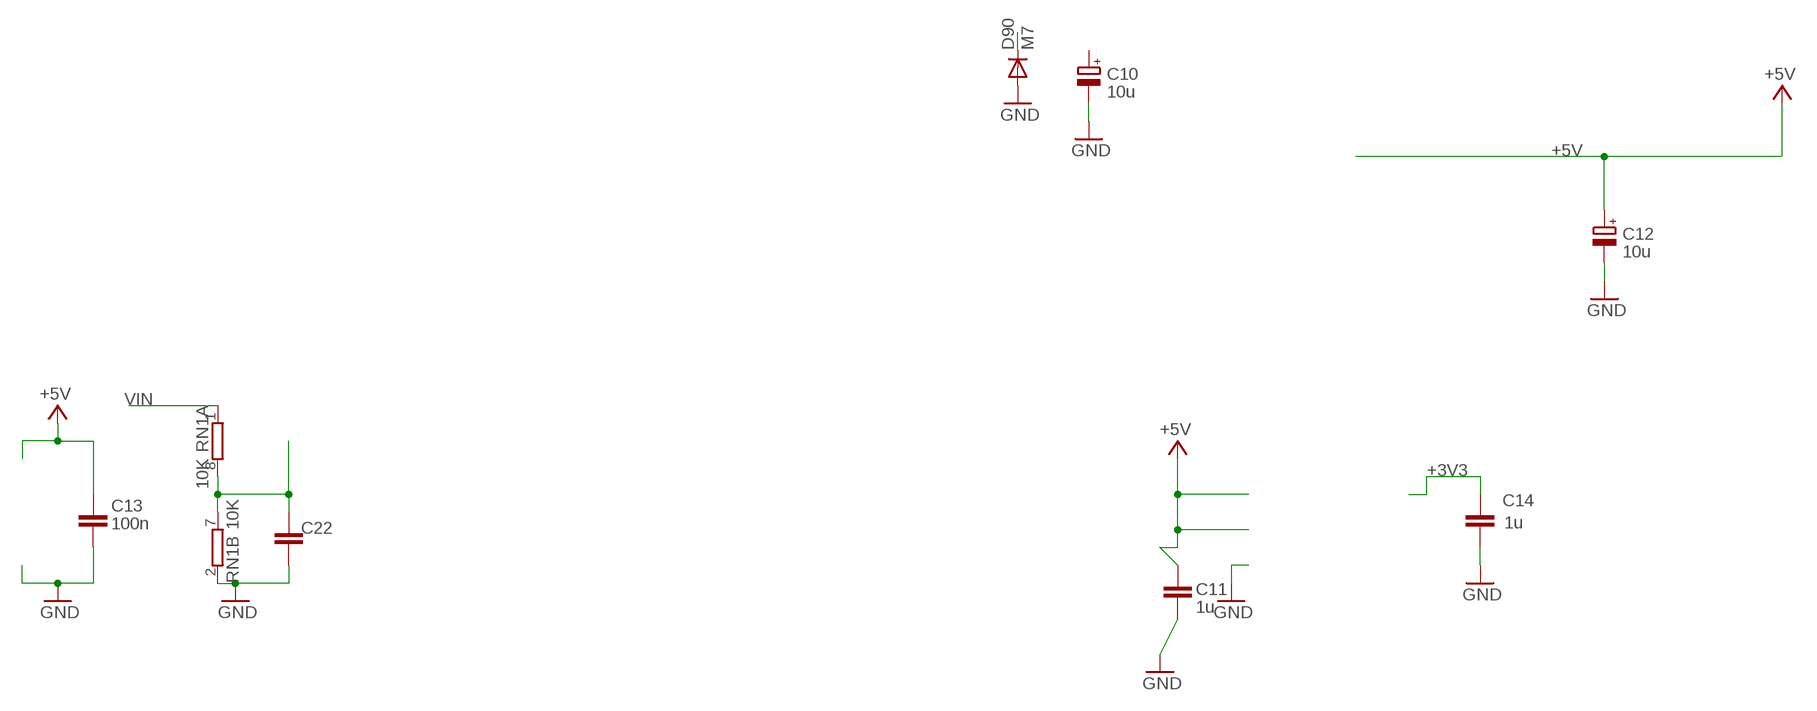
[diagram p6: schematic, sheet 2, part 2 of 3]
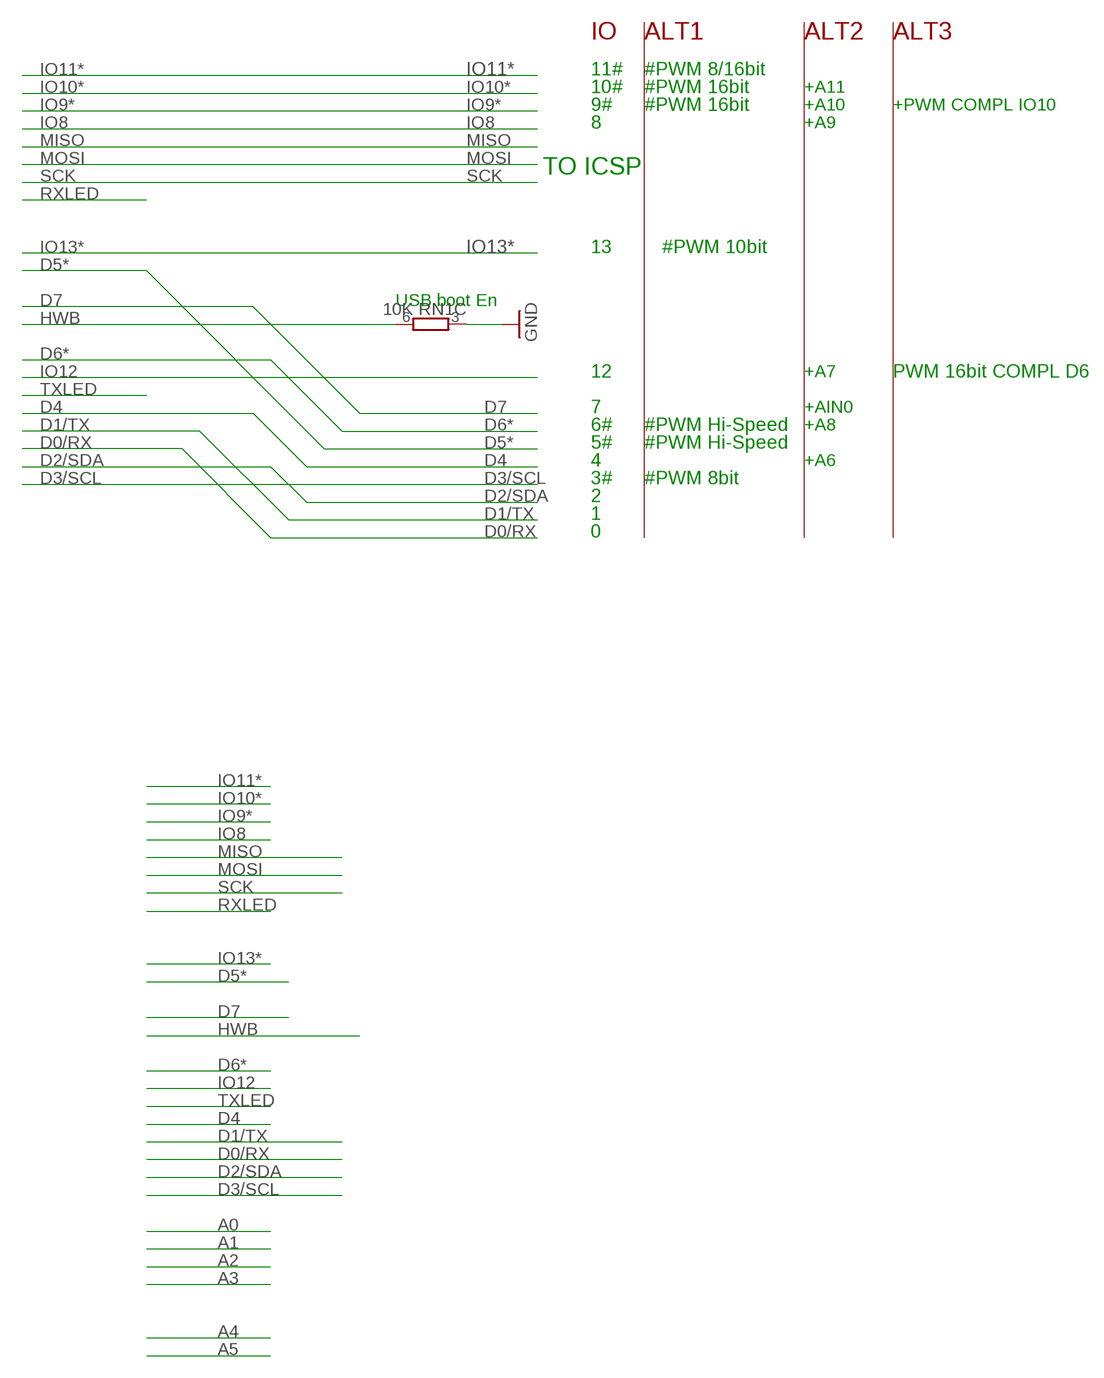
[diagram p7: schematic, sheet 2, part 3 of 3]

### Parts
1C13  100n  C-EUC0805  [C0805]
1C14  100n  C-EUC0805  [C0805]
3D2  ATMEGA168-AU  ATMEGA48/88/168-AU  [TQFP32-08]
C3  22  C-EUC0805  [C0805]
C4  22  C-EUC0805  [C0805]
C10  10u  CPOL-EUSMCB  [SMC_B]
C11  1u  C-EUC0603  [C0603-ROUND]
C12  10u  CPOL-EUSMCB  [SMC_B]
C13  100n  C-EUC0603  [C0603-ROUND]
C14  1u  C-EUC0603  [C0603-ROUND]
C22  100n  C-EUC0603  [C0603-ROUND]
D90  M7  DIODE-SMB  [SMB]
IC2  74HC595D  [SO16]
IC3  74HC595D  [SO16]
IC4  74HC595D  [SO16]
IC5  74HC595D  [SO16]
IC6  MEGA16-A  [TQFP44]
IOL1  8x1F-H8.5  PINHD-1X8  [1X08]
IOL2  8x1F-H8.5  PINHD-1X8  [1X08]
IOL3  8x1F-H8.5  PINHD-1X8  [1X08]
IOL4  8x1F-H8.5  PINHD-1X8  [1X08]
ISP3  MA03-2  [MA03-2]
Q1  16M  CRYSTALHC49S  [HC49/S]
R3  R-EU_R0805  [R0805]
RN1  10K  4R-NCAY16  [CAY16]

### Nets
+3V3: C14.2
+5V: 1C13.1 3D2.4(VCC) 3D2.6(VCC) 3D2.18(AVCC) C11.2 C12.+ C13.1 IC2.10(SCL) IC3.10(SCL) IC4.10(SCL) IC5.10(SCL) ISP3.2 R3.2 ; also sheet 1
CMP: C22.2 RN1.7 RN1.8
GND: 1C13.2 1C14.2 3D2.3(GND) 3D2.5(GND) 3D2.21(AGND) C3.1 C4.1 C10.- C11.1 C12.- C13.2 C14.1 C22.1 D90.A IC2.13(G) IC3.13(G) IC4.13(G) IC5.13(G) ISP3.6 RN1.2 RN1.3 ; also sheet 1
HWB: RN1.6 ; also sheet 1
MISO: ISP3.1
MISO0: 3D2.16(PB4(MISO/PCINT4)) ; also sheet 1
MOSI: ISP3.4
MOSI0: 3D2.15(PB3(MOSI/OC2A/PCINT3)) ; also sheet 1
N$30: 3D2.8(PB7(XTAL2/TOSC2/PCINT7)) C4.2 Q1.1
N$42: IC2.9(QH*) IC3.14(SER)
N$44: IC2.11(SCK) IC3.11(SCK) IC4.11(SCK) IC5.11(SCK)
N$51: IC2.12(RCK) IC3.12(RCK) IC4.12(RCK) IC5.12(RCK)
N$71: IC3.9(QH*) IC4.14(SER)
N$72: IC4.9(QH*) IC5.14(SER)
N$73: 3D2.7(PB6(XTAL1/TOSC1/PCINT6)) C3.2 Q1.2
N$77: 3D2.14(PB2(SS/OC1B/PCINT2))
N$78: 1C14.1 3D2.20(AREF)
N$87: IC6.30((ADC7)PA7) IC6.31((ADC6)PA6)
REG1: IC2.14(SER)
RESET: ISP3.5
RESET0: 3D2.29(PC6(/RESET/PCINT14)) R3.1 ; also sheet 1
RXP: 3D2.30(PD0(RXD/PCINT16))
SCK: ISP3.3
SCK0: 3D2.17(PB5(SCK/PCINT5)) ; also sheet 1
TXP: 3D2.31(PD1(TXD/PCINT17))
VIN [power]: D90.C RN1.1
Unconnected: 3D2.1(PD3(INT1/OC2B/PCINT19)) 3D2.2(PD4(T0/XCK/PCINT20)) 3D2.9(PD5(T1/OC0B/PCINT21)) 3D2.10(PD6(AIN0/OC0A/PCINT22)) 3D2.11(PD7(AIN1/PCINT23)) 3D2.12(PB0(ICP1/CLKO/PCINT0)) 3D2.13(PB1(OC1A/PCINT1)) 3D2.19(ADC6) 3D2.22(ADC7) 3D2.23(PC0(ADC0/PCINT8)) 3D2.24(PC1(ADC1/PCINT9)) 3D2.25(PC2(ADC2/PCINT10)) 3D2.26(PC3(ADC3/PCINT11)) 3D2.27(PC4(ADC4/SDA/PCINT12)) 3D2.28(PC5(ADC5/SCL/PCINT13)) 3D2.32(PD2(INT0/PCINT18)) C10.+ IC2.1(QB) IC2.2(QC) IC2.3(QD) IC2.4(QE) IC2.5(QF) IC2.6(QG) IC2.7(QH) IC2.15(QA) IC3.1(QB) IC3.2(QC) IC3.3(QD) IC3.4(QE) IC3.5(QF) IC3.6(QG) IC3.7(QH) IC3.15(QA) IC4.1(QB) IC4.2(QC) IC4.3(QD) IC4.4(QE) IC4.5(QF) IC4.6(QG) IC4.7(QH) IC4.15(QA) IC5.1(QB) IC5.2(QC) IC5.3(QD) IC5.4(QE) IC5.5(QF) IC5.6(QG) IC5.7(QH) IC5.9(QH*) IC5.15(QA) IC6.1((MOSI)PB5) IC6.2((MISO)PB6) IC6.3((SCK)PB7) IC6.4(RESET) IC6.7(XTAL2) IC6.8(XTAL1) IC6.9((RXD)PD0) IC6.10((TXD)PD1) IC6.11((INT0)PD2) IC6.12((INT1)PD3) IC6.13((OC1B)PD4) IC6.14((OC1A)PD5) IC6.15((ICP)PD6) IC6.16((OC2)PD7) IC6.19(PC0(SCL)) IC6.20(PC1(SDA)) IC6.21((TCK)PC2) IC6.22((TMS)PC3) IC6.23((TDO)PC4) IC6.24((TDI)PC5) IC6.25((TOSC1)PC6) IC6.26((TOSC2)PC7) IC6.29(AREF) IC6.32((ADC5)PA5) IC6.33((ADC4)PA4) IC6.34((ADC3)PA3) IC6.35((ADC2)PA2) IC6.36((ADC1)PA1) IC6.37((ADC0)PA0) IC6.40((T0/XCK)PB0) IC6.41((T1)PB1) IC6.42((AIN0/INT2)PB2) IC6.43((AIN1/OC0)PB3) IC6.44((SS)PB4) IOL1.1 IOL1.2 IOL1.3 IOL1.4 IOL1.5 IOL1.6 IOL1.7 IOL1.8 IOL2.1 IOL2.2 IOL2.3 IOL2.4 IOL2.5 IOL2.6 IOL2.7 IOL2.8 IOL3.1 IOL3.2 IOL3.3 IOL3.4 IOL3.5 IOL3.6 IOL3.7 IOL3.8 IOL4.1 IOL4.2 IOL4.3 IOL4.4 IOL4.5 IOL4.6 IOL4.7 IOL4.8 RN1.4 RN1.5

### Notes on the sheet
- 31.03.2009 | 17 февраля 2012
- AvrUsb500v2 | RadioKot | Bonio
- ?out reset | out 1Mhz | out reset
- x | out_MOSI
- x | rst adc | vcc a out
- x | out reset | x
- x | out sck | LED_TARGET
- x | out miso | vcc out
- - | x | x
- - | x | x
- ft232 tx | ft232 tx | cp2102 tx
- ft232 rx | ft232 rx | cp2102 rx
- out sck | x | x
- out miso | x | x
- out_MOSI | x | s1 boot
- x | x | LED_ready
- x | x | x
- x | x | x
- x | cp2102 suspend
- LED_TARGET | x | out mhz
- out mhz | LED_TARGET | LED_active
- FT232_MOSI | FT232_MOSI | out_MOSI
- FT232_MISO | FT232_MISO | out miso
- FT232_SCK | FT232_SCK | out sck
- green
- ano
- HVPP | Petka
- делитель
- led green ready &
- led red & | LED_TARGET
- x
- x
- x
- x
- blue
- d7 & isp | FT232_SCK
- d6 & isp | FT232_MISO
- d5 & isp | FT232_MOSI
- d4
- d3
- d2
- d1
- d0
- pagel
- red | xa0
- xa1
- bs1
- wr | IO | ALT1 | ALT2 | ALT3
- oe
- rb | 11# | #PWM 8/16bit
- bs2 | 10# | #PWM 16bit | +A11
- 9# | #PWM 16bit | +A10 | +PWM COMPL IO10
- sw clk | 8 | +A9
- 74hc165
- sw vtg
- TO ICSP
- x
- hw on
- sw trst
- tx | tx
- rx | rx | 13 | #PWM 10bit
- USB boot En
- 12 | +A7 | PWM 16bit COMPL D6
- 7 | +AIN0
- 6# | #PWM Hi-Speed | +A8
- 5# | #PWM Hi-Speed
- 4 | +A6
- 3# | #PWM 8bit
- 2
- 1
- 0

## Power pins joined to a net without a drawn wire
5-GND: RESET1.5(5-GND) RESET2.5(5-GND)
AVCC: IC6.27(AVCC)
GND: IC2.8(GND) IC3.8(GND) IC4.8(GND) IC5.8(GND) IC6.6(GND) IC6.28(GND)
GND1: IC6.18(GND1)
GND2: IC6.39(GND2)
VCC: IC2.16(VCC) IC3.16(VCC) IC4.16(VCC) IC5.16(VCC) IC6.5(VCC)
VCC1: IC6.17(VCC1)
VCC2: IC6.38(VCC2)

## Library data of the parts
1C1-1C6 1C8-1C10 1C13 1C14 1C19-1C24 2C4 2C5 3C7 3C10 4C2 C2 C18 C20 C24 R100 = rcl:C-EU: CAPACITOR, European symbol
1C7 C10 C12 = rcl:CPOL-EU: POLARIZED CAPACITOR, European symbol
1D1 = imcom:FE1.1S: A USB 2.0 hub IC. http://www.jfd-ic.com/Documents/FE1.1s%20Data%20Sheet%20%28Rev.%201.0%29.pdf
1R1-1R12 1R14-1R17 1R28-1R42 1RJ 3R5-3R8 4R6-4R10 PINS R1 R2 R4-R13 R15-R21 RJ4 = rcl:R-EU_: RESISTOR, European symbol
1VD3 3VD2 = diode:SCHOTTKY-DIODE: Schottky Diode
1VT4 1VT6 = transistor:BC847: NPN TRANSISTOR
1VT5 = transistor:*-PNP-: PNP Transistror
1X1 = detali_controller:USB-B_PN61729-S: BERG USB connector
1X2 = imcom:USB_TYPE_A_FEMALE_TH: USB Type A Female Through Hole. http://datasheet.octopart.com/787616-1-Tyco-Electronics-datasheet-61477.pdf
1Z1 2Z1 Z1A = crystal:CRYSTAL: CRYSTAL; OC_FARNELL: 1667008; OC_NEWARK: unknown
2C1-2C3 = resistor:C-EU: CAPACITOR, European symbol
2D1 = SparkFun-DigitalIC:PL-2303XA: Prolific USB chip, requires 12MHz xtal
2D2 = microchip:24C*: Serial EEPROM 1 K/2 K/4 K; MF: MICROCHIP; MPN: 24C02C/P; OC_FARNELL: 1296567; OC_NEWARK: 96K4064
2R1-2R8 = resistor:R-EU_: RESISTOR, European symbol
2R9 2R10 R3 = keycopy:R-EU_: RESISTOR, European symbol
3C6 = rc-elektronik:C-EU: CAPACITOR, European symbol
3C8 3C9 = HWProgUSB:RCL_CPOL-EU: POLARIZED CAPACITOR, European symbol
3D2 = atmega8:ATMEGA48/88/168
3L2 = rcl:L-US: INDUCTOR, American symbol
4D1 = detali_main:SMARTPRJ_ATMEGA32U4-XU
4VT4 = transistor-neu-to92:BC847: NPN TRANSISTOR
4VT5 = transistor-power:FDN360P: Single P-Channel, PowerTrench (R) MOSFET Source: http://www.fairchildsemi.com/ds/FD/FDN360P.pdf
4VT6 = transistor-small-signal:BSS123: N-CHANNEL MOS FET
5D1 = atmel:MEGA8535: MICROCONTROLLER 8 Kbytes FLASH 512 bytes SRAM 512 bytes EEPROM USART 8-channel 10 bit ADC Source: avr.lbr; MPN: ATMEGA8535-16AU; OC_FARNELL: 1528437; OC_NEWARK: 01M6908
5D2 = 74xx-eu:74*165: 8-bit parallel load SHIFT REGISTER
5D3 = mc34063:MC34063
5D4 5D6 = 74xx-eu:74*244: Octal BUFFER and LINE DRIVER, 3-state
5D5 = 40xx:4011: Quad 2-input NAND
!OE !WR BS1 BS2 DATA0 DATA1-DATA7 PAG R/!B RES XA0 XA1 XTAL1 = pinhead:PINHD-1X1: PIN HEADER
C1 C11 C13 C14 C17 C19 C22 = SmartPrj:C-EU: CAPACITOR, European symbol
C3 C4 = keycopy:C-EU: CAPACITOR, European symbol
D1 D90 = diode:DIODE-: DIODE
D2 D3 D6-D11 = detali_controller:LL4148: DIODE high speed
F1 F2 = rcl:L-EU: INDUCTOR, European symbol
HL1-HL4 HW LED READY RESET = led:LED: LED OSRAM: - CHIPLED LG R971, LG N971, LY N971, LG Q971, LY Q971, LO R971, LY R971 LH N974, LH R974 LS Q976, LO Q976, LY Q976 LO Q996 - Hyper CHIPLED LW Q18S LB Q993, LB Q99A, LB R99A - SideLED LS A670, LO A670, LY A670, LG A670, LP A670 LB A673, LV A673, LT A673, LW A673 LH A674 LY A675 LS A676, LA A676, LO A676, LY A676, LW A676 LS A679, LY A679, LG A679 - Hyper Micro SIDELED® LS Y876, LA Y876, LO Y876, LY Y876 LT Y87S - SmartLED LW L88C, LW L88S LB L89C, LB L89S, LG L890 LS L89K, LO L89K, LY L89K LS L896, LA L896, LO L896, LY L896 - TOPLED LS T670, LO T670, LY T670, LG T670, LP T670 LSG T670, LSP T670, LSY T670, LOP T670, LYG T670 LG T671, LOG T671, LSG T671 LB T673, LV T673, LT T673, LW T673 LH T674 LS T676, LA T676, LO T676, LY T676, LB T676, LH T676, LSB T676, LW T676 LB T67C, LV T67C, LT T67C, LS T67K, LO T67K, LY T67K, LW E67C LS E67B, LA E67B, LO E67B, LY E67B, LB E67C, LV E67C, LT E67C LW T67C LS T679, LY T679, LG T679 LS T770, LO T770, LY T770, LG T770, LP T770 LB T773, LV T773, LT T773, LW T773 LH T774 LS E675, LA E675, LY E675, LS T675 LS T776, LA T776, LO T776, LY T776, LB T776 LHGB T686 LT T68C, LB T68C - Hyper Mini TOPLED® LB M676 - Mini TOPLED Santana® LG M470 LS M47K, LO M47K, LY M47K Source: http://www.osram.convergy.de LUXEON: - LUMILED® LXK2-PW12-R00, LXK2-PW12-S00, LXK2-PW14-U00, LXK2-PW14-V00 LXK2-PM12-R00, LXK2-PM12-S00, LXK2-PM14-U00 LXK2-PE12-Q00, LXK2-PE12-R00, LXK2-PE12-S00, LXK2-PE14-T00, LXK2-PE14-U00 LXK2-PB12-K00, LXK2-PB12-L00, LXK2-PB12-M00, LXK2-PB14-N00, LXK2-PB14-P00, LXK2-PB14-Q00 LXK2-PR12-L00, LXK2-PR12-M00, LXK2-PR14-Q00, LXK2-PR14-R00 LXK2-PD12-Q00, LXK2-PD12-R00, LXK2-PD12-S00 LXK2-PH12-R00, LXK2-PH12-S00 LXK2-PL12-P00, LXK2-PL12-Q00, LXK2-PL12-R00 Source: www.luxeon.com KINGBRIGHT: KA-3528ASYC Source: www.kingbright.com
HW1 = HWProgUSB:PINHEAD_PINHD-1X2: PIN HEADER
IC2-IC5 = 74xx-eu:74*595: 8-bit SHIFT REGISTER, output latch
IC6 = atmel:MEGA16: MICROCONTROLLER 16 Kbytes FLASH 1 kbytes SRAM 512 bytes EEPROM USART 8-channel 10 bit ADC Source: avr.lbr; MPN: ATMEGA16-16AU; OC_FARNELL: 9171134; OC_NEWARK: 96K6515
ICSP1 LEDS = SmartPrj:PINHD-2X3: PIN HEADER
IOL1-IOL4 = SmartPrj:PINHD-1X8: PIN HEADER
ISP1 ISP3 = con-lstb:MA03-2: PIN HEADER
J1 J2 J5 J6 J_U1 JI2 JO2 JR2 JS2 JV1 JX1 U_U1-U_U4 = jumper:SJ: SMD solder JUMPER
J_U2 = detali_controller:J
JP1 = HWProgUSB:JUMPER_JP2E: JUMPER
JP2 = jumper:JP2E: JUMPER
L1 L3 = wuerth-elektronik:WE-CBF: SMD EMI Suppression Ferrite Beads - excellent anti-EMI properties - low DCR - impedances till 3000 ohms - rated current up to 6 A
P_RESET T_RESET = jumper:JP1E: JUMPER
Q1 = keycopy:CRYSTAL: CRYSTAL; OC_FARNELL: 1667008; OC_NEWARK: unknown
RES1 = jump-0r-smd:0R-JUMP: SMD 0R 0805 Jumper
RESET1 RESET2 = SmartPrj:TS42: TS42 Dongnan Electronics Tact switch VDC 12V - 50mA
RN RN1 = resistor-dil:4R-N: Array Chip Resistor Source: RS Component / Phycomp
RU1 RU2 = varistor:VARISTOR: VARISTOR
SV2 = detali_main:FE03-1: FEMALE HEADER; OC_FARNELL: unknown; OC_NEWARK: unknown
SV3 = detali_main:FE08-1: FEMALE HEADER; OC_FARNELL: unknown; OC_NEWARK: unknown
SV5 = detali_main:FE09-1: FEMALE HEADER; OC_FARNELL: unknown; OC_NEWARK: unknown
SV6 = detali_main:FE12-1: FEMALE HEADER; OC_FARNELL: unknown; OC_NEWARK: unknown
Z1 = SmartPrj:CRYSTAL-3.2-2.5
Z3 = crystal:CRYTAL: CRYSTAL

## Net classes
1 power: width 0.254 mm, drill 0.61 mm, clearance 0.254 mm
2 gnd: width 0.305 mm, drill 0.559 mm, clearance 0.254 mm
3 usbvcc: width 0.508 mm, drill 0.61 mm, clearance 0.254 mm
4 aref: width 0.254 mm, drill 0.61 mm, clearance 0.254 mm